# EAGLE design placa esp 30 pins V1 (EAGLE 7.2.0)
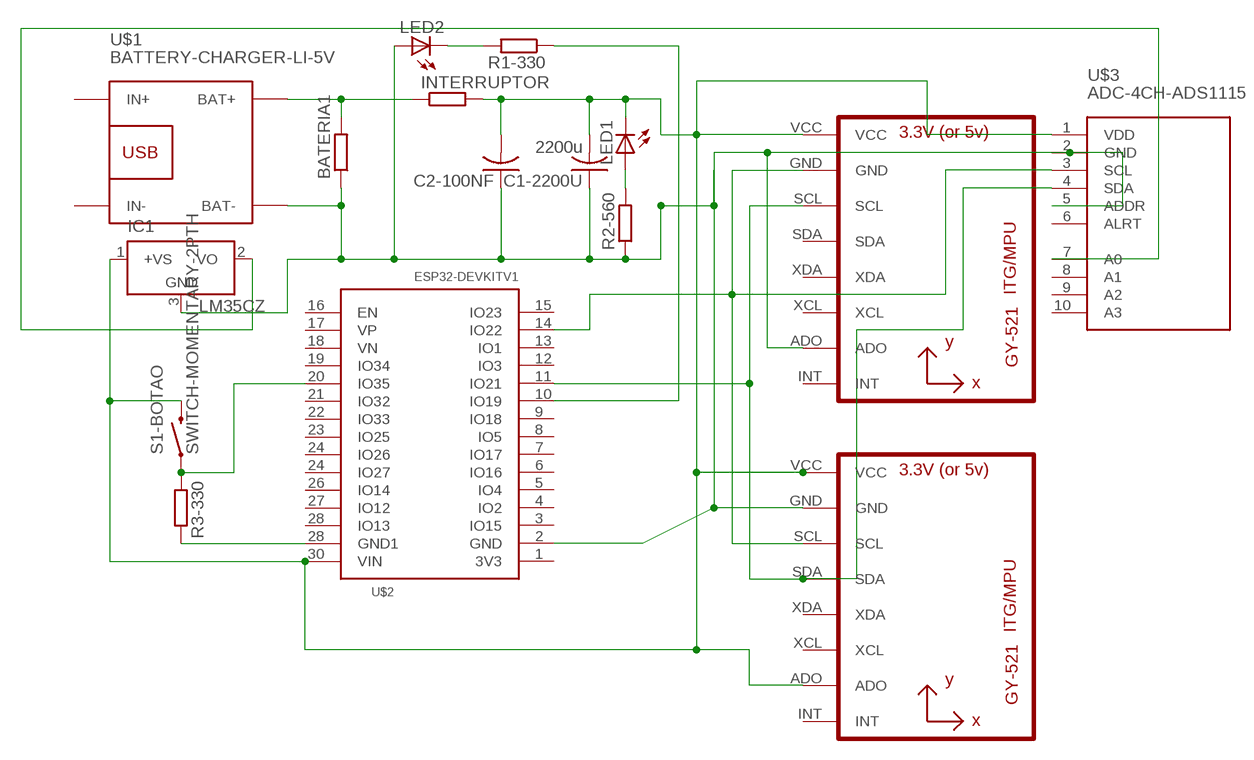
[diagram p0: schematic, sheet 1]

## Parts
BATERIA1  R-EU_0207/10  [0207/10]
C1-2200U  2200u  C-US025-060X050  [C025-060X050]
C2-100NF  C-US025-060X050  [C025-060X050]
IC1  LM35CZ  [TO92]
INTERRUPTOR  R-EU_0207/7  [0207/7]
LED1  LEDLD260  [LD260]
LED2  LEDLD260  [LD260]
OXIMETRO  GY-521MPU6050  [GY-521]
R1-330  R-EU_0207/10  [0207/10]
R2-560  R-EU_0207/10  [0207/10]
R3-330  R-EU_0207/10  [0207/10]
S1-BOTAO  SWITCH-MOMENTARY-2PTH  [TACTILE-PTH]
U2  GY-521MPU6050  [GY-521]
U$1  BATTERY-CHARGER-LI-5V  [BATTERY-CHARGER-LI-5V]
U$2  ESP32DEVKITV1  [ESP32-DEVKITV1]
U$3  ADC-4CH-ADS1115  [ADC-4CH-ADS1115]

## Nets
N$1: C1-2200U.2 C2-100NF.2 IC1.1(+VS) INTERRUPTOR.2 LED1.K(C) OXIMETRO.VCC S1-BOTAO.3 U2.ADO U2.VCC U$2.30(VIN) U$3.1(VDD)
N$3: OXIMETRO.GND U2.SCL U$2.14(IO22) U$3.3(SCL)
N$4: R3-330.1 S1-BOTAO.1 U$2.20(IO35)
N$5: IC1.2(VO) U$3.7(A0)
N$6: OXIMETRO.SCL U2.SDA U$2.11(IO21) U$3.4(SDA)
N$8: R3-330.2 U$2.28(GND1)
N$9: LED1.A R2-560.2
N$10: BATERIA1.2 INTERRUPTOR.1 U$1.BAT+
N$11: LED2.K(C) R1-330.2
N$12: BATERIA1.1 C1-2200U.1 C2-100NF.1 IC1.3(GND) LED2.A OXIMETRO.ADO R2-560.1 U2.GND U$1.BAT- U$2.2(GND) U$3.2(GND) U$3.5(ADDR)
N$13: R1-330.1 U$2.10(IO19)
Unconnected: OXIMETRO.INT OXIMETRO.SDA OXIMETRO.XCL OXIMETRO.XDA U2.INT U2.XCL U2.XDA U$1.IN+ U$1.IN- U$2.1(3V3) U$2.3(IO15) U$2.4(IO2) U$2.5(IO4) U$2.6(IO16) U$2.7(IO17) U$2.8(IO5) U$2.9(IO18) U$2.12(IO3) U$2.13(IO1) U$2.15(IO23) U$2.16(EN) U$2.17(VP) U$2.18(VN) U$2.19(IO34) U$2.21(IO32) U$2.22(IO33) U$2.23(IO25) U$2.24(IO26) U$2.24(IO27) U$2.26(IO14) U$2.27(IO12) U$2.28(IO13) U$3.6(ALRT) U$3.8(A1) U$3.9(A2) U$3.10(A3)

## Library data of the parts
BATERIA1 INTERRUPTOR R1-330 R2-560 R3-330 = resistor:R-EU_: RESISTOR, European symbol
C1-2200U C2-100NF = resistor:C-US: CAPACITOR, American symbol
IC1 = lm35:LM35: Single-Supply Centigrade Temperature Sensor Vout = (10mV/°C x Temp °C) +5mmmV Source: http://www.national.com/ds/LM/LM35.pdf
LED1 LED2 = led:LED: LED OSRAM: - CHIPLED LG R971, LG N971, LY N971, LG Q971, LY Q971, LO R971, LY R971 LH N974, LH R974 LS Q976, LO Q976, LY Q976 LO Q996 - Hyper CHIPLED LW Q18S LB Q993, LB Q99A, LB R99A - SideLED LS A670, LO A670, LY A670, LG A670, LP A670 LB A673, LV A673, LT A673, LW A673 LH A674 LY A675 LS A676, LA A676, LO A676, LY A676, LW A676 LS A679, LY A679, LG A679 - Hyper Micro SIDELED® LS Y876, LA Y876, LO Y876, LY Y876 LT Y87S - SmartLED LW L88C, LW L88S LB L89C, LB L89S, LG L890 LS L89K, LO L89K, LY L89K LS L896, LA L896, LO L896, LY L896 - TOPLED LS T670, LO T670, LY T670, LG T670, LP T670 LSG T670, LSP T670, LSY T670, LOP T670, LYG T670 LG T671, LOG T671, LSG T671 LB T673, LV T673, LT T673, LW T673 LH T674 LS T676, LA T676, LO T676, LY T676, LB T676, LH T676, LSB T676, LW T676 LB T67C, LV T67C, LT T67C, LS T67K, LO T67K, LY T67K, LW E67C LS E67B, LA E67B, LO E67B, LY E67B, LB E67C, LV E67C, LT E67C LW T67C LS T679, LY T679, LG T679 LS T770, LO T770, LY T770, LG T770, LP T770 LB T773, LV T773, LT T773, LW T773 LH T774 LS E675, LA E675, LY E675, LS T675 LS T776, LA T776, LO T776, LY T776, LB T776 LHGB T686 LT T68C, LB T68C - Hyper Mini TOPLED® LB M676 - Mini TOPLED Santana® LG M470 LS M47K, LO M47K, LY M47K Source: http://www.osram.convergy.de LUXEON: - LUMILED® LXK2-PW12-R00, LXK2-PW12-S00, LXK2-PW14-U00, LXK2-PW14-V00 LXK2-PM12-R00, LXK2-PM12-S00, LXK2-PM14-U00 LXK2-PE12-Q00, LXK2-PE12-R00, LXK2-PE12-S00, LXK2-PE14-T00, LXK2-PE14-U00 LXK2-PB12-K00, LXK2-PB12-L00, LXK2-PB12-M00, LXK2-PB14-N00, LXK2-PB14-P00, LXK2-PB14-Q00 LXK2-PR12-L00, LXK2-PR12-M00, LXK2-PR14-Q00, LXK2-PR14-R00 LXK2-PD12-Q00, LXK2-PD12-R00, LXK2-PD12-S00 LXK2-PH12-R00, LXK2-PH12-S00 LXK2-PL12-P00, LXK2-PL12-Q00, LXK2-PL12-R00 Source: www.luxeon.com KINGBRIGHT: KA-3528ASYC Source: www.kingbright.com
OXIMETRO U2 = gy-521:GY-521
S1-BOTAO = SparkFun-Electromechanical:SWITCH-MOMENTARY-2: Various NO switches- pushbuttons, reed, etc; PROD_ID: SWCH-08441
U$1 = diy-modules:BATTERY-CHARGER-LI-5V: Lithium Battery 5V Charger
U$2 = ESP32-DEVKITV1:ESP32DEVKITV1
U$3 = diy-modules (1):ADC-4CH-ADS1115: 4 Channel 16-Bit Analog-to-Digital Converter based on ADS1115 chip Arduino ADS1115 Getting Started Tutorial is available here: http://henrysbench.capnfatz.com/henrys-bench/arduino-voltage-measurements/arduino-ads1115-module-getting-started-tutorial/ ADS1115 datasheet is available here: http://www.ti.com/lit/ds/symlink/ads1115.pdf Click here to find device on ebay.com <http://www.ebay.com/sch/ads1115+module>

## Board
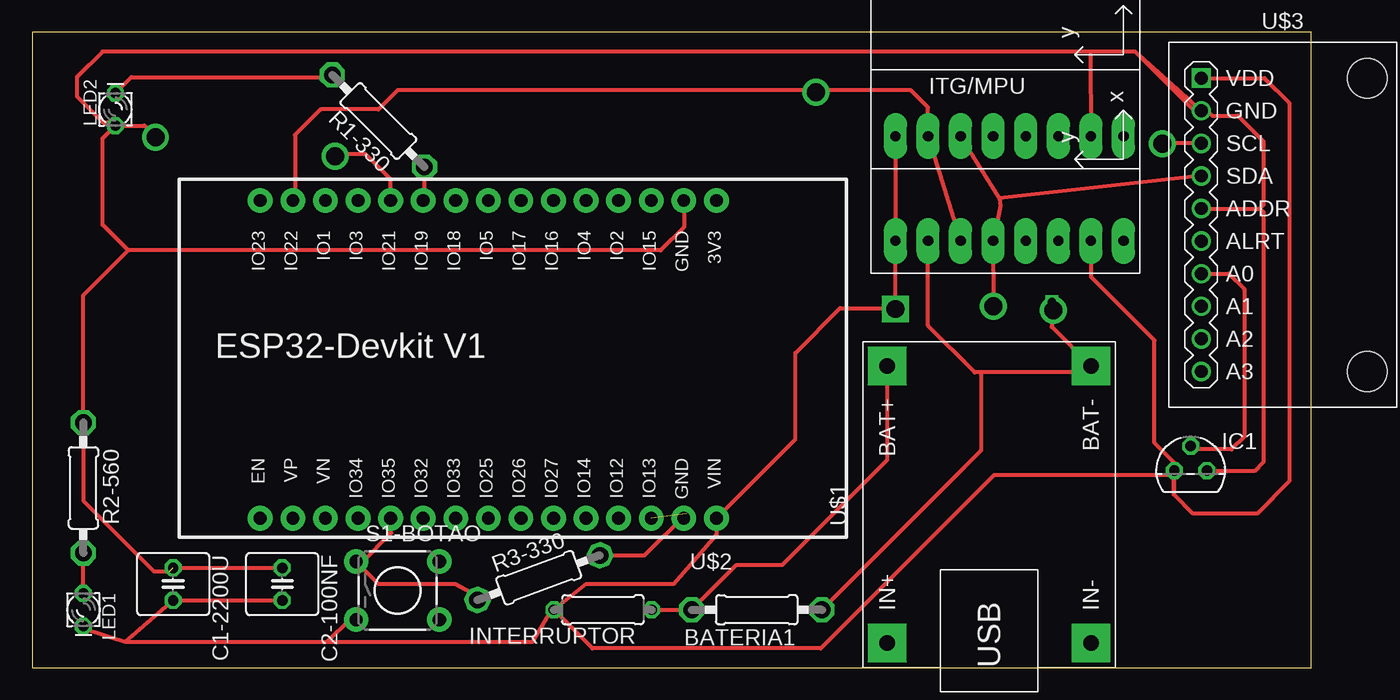
[diagram p1: board, top side]
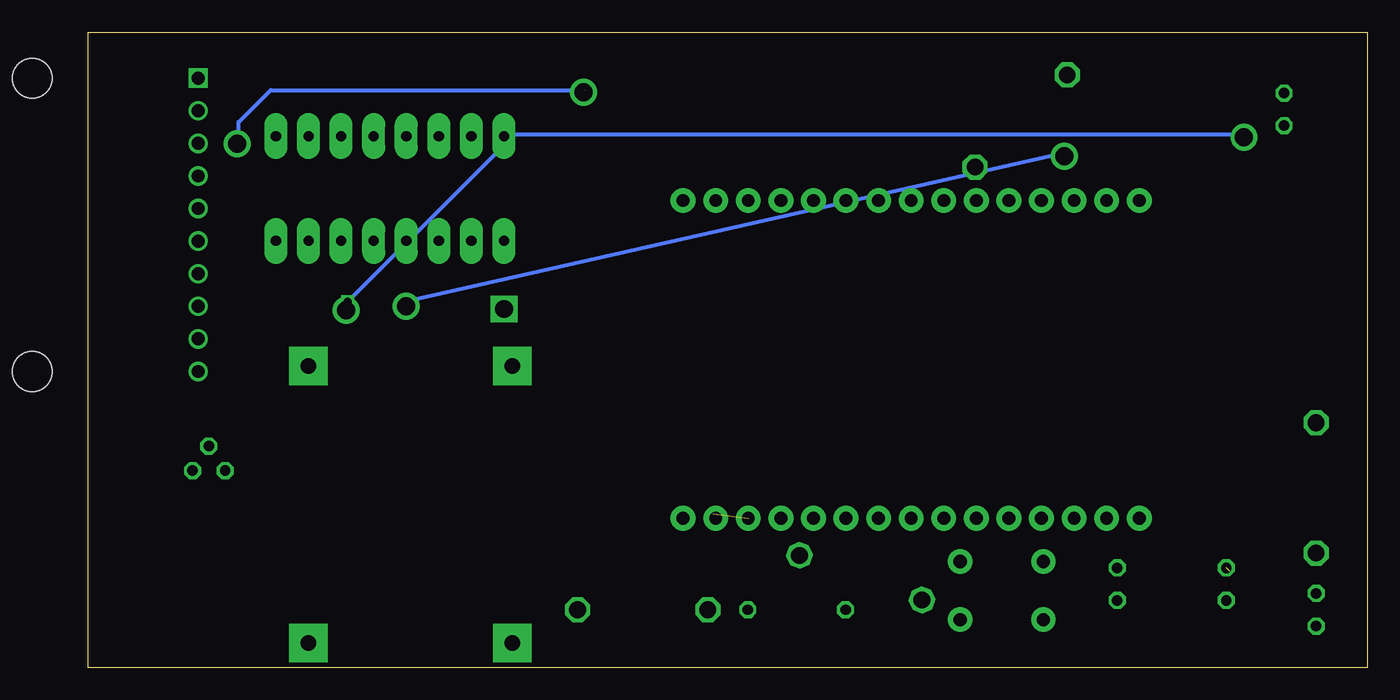
[diagram p2: board, bottom side, seen from below]

Size 99.73 x 49.52 mm. Coordinates in mm from the lower left corner, seen from the top.
Outline: 0,0 99.73,0 99.73,49.52 0,49.52 0,0
Copper layers (1*16): Top 0.035mm / dielectric 1.5mm / Bottom 0.035mm
Design rules "default": minimum track width 10mil, minimum drill 24mil, track to track 8mil, track to pad 8mil, pad to pad 8mil, via to via 8mil, smd to smd 8mil, copper to edge 40mil, drill to drill 8mil, minimum pad ring 10mil, minimum via ring 8mil, stop-mask expansion 4mil, vias tented up to drill 0mil, thermal gap 10mil

### Footprints (pad centres in the part's own frame; a part is rotated, then mirrored left to right if it is on the bottom)
0207/10 = drill 1.3 octagon: 1 -5.08,0; 2 5.08,0
C025-060X050 = drill 0.813 octagon: 1 -1.27,0; 2 1.27,0
TO92 = drill 0.813 octagon: 1 -1.27,0; 2 0,1.905; 3 1.27,0
0207/7 = drill 0.813 octagon: 1 -3.81,0; 2 3.81,0
LD260 = drill 0.813 octagon: A -1.27,0; K 1.27,0
GY-521 = drill 0.8 pad 1.778 long: ADO -8.89,-6.35; GND -8.89,6.35; INT -8.89,-8.89; SCL -8.89,3.81; SDA -8.89,1.27; VCC -8.89,8.89; XCL -8.89,-3.81; XDA -8.89,-1.27
TACTILE-PTH = drill 1.016 pad 1.88: 1 -3.251,2.261; 2 3.251,2.261; 3 -3.251,-2.261; 4 3.251,-2.261
BATTERY-CHARGER-LI-5V = drill 1.2 pad 3 square: BAT+ 10.795,8.255; BAT- 10.795,-7.62; IN+ -10.795,8.255; IN- -10.795,-7.62
ESP32-DEVKITV1 = drill 1 pad 1.93: 1 -22.87,-13.54; 2 -20.33,-13.54; 3 -17.79,-13.54; 4 -15.25,-13.54; 5 -12.71,-13.54; 6 -10.17,-13.54; 7 -7.63,-13.54; 8 -5.09,-13.54; 9 -2.55,-13.54; 10 -0.01,-13.54; 11 2.53,-13.54; 12 5.07,-13.54; 13 7.61,-13.54; 14 10.15,-13.54; 15 12.69,-13.54; 16 12.69,11.23; 17 10.15,11.23; 18 7.61,11.23; 19 5.07,11.23; 20 2.53,11.23; 21 -0.01,11.23; 22 -2.55,11.23; 23 -5.09,11.23; 24 -7.63,11.23; 25 -10.17,11.23; 26 -12.71,11.23; 27 -15.25,11.23; 28 -17.79,11.23; 29 -20.33,11.23; 30 -22.87,11.23
ADC-4CH-ADS1115 = drill 1 square: 1 -6.35,11.43 | drill 1: 2 -6.35,8.89; 3 -6.35,6.35; 4 -6.35,3.81; 5 -6.35,1.27; 6 -6.35,-1.27; 7 -6.35,-3.81; 8 -6.35,-6.35; 9 -6.35,-8.89; 10 -6.35,-11.43 | hole 3.1: 6.604,11.43; 6.604,-11.43

### Placement (x,y rotation side)
BATERIA1  56.5,4.5 180 top
C1-2200U  11,6.5 270 top
C2-100NF  19.5,6.5 270 top
IC1  90.32,15.35 0 top
INTERRUPTOR  44.5,4.5 180 top
LED1  4,4.5 270 top
LED2  6.5,43.5 90 top
OXIMETRO  76.2,50.3 90 top
R1-330  27,42.59 135 top
R2-560  4,14 270 top
R3-330  39.5,7 20 top
S1-BOTAO  28.5,6 0 top
U2  76.2,42.14 90 top
U$1  74.93,12.7 90 top
U$2  30.48,22.86 180 top
U$3  97.5,34.5 0 top

### Tracks (layer width: path | path; a pad name or v marks a point on that pad's centre or on a via)
N$1
  Top 0.305: OXIMETRO.VCC U2.VCC 67.31,28.19 67.5,28 63,28 59.5,24.5 59.5,17.78 U$2.30 53.35,10.35 50,6.5 43.19,6.5 INTERRUPTOR.2 | LED1.K 4.23,3 7.27,2 | 7.27,2 23,2 | 23,2 39,2 40.5,4.5 INTERRUPTOR.2 | 89.05,13.45 90.5,12 95.5,12 98,14.5 98,44 96.07,45.93 U$3.1 | 89.05,13.45 IC1.1 | 89.05,13.45 89,13.5 89,15 | 89,15 89,16 87.5,17.5 87.5,25.5 82.55,30.45 U2.ADO | 89,15 75,15 61.5,1.5 43.69,1.5 INTERRUPTOR.2 | 7.27,2 C1-2200U.2 C2-100NF.2 | S1-BOTAO.3 24.74,3.74 23,2
N$3  (via drill 0.6)  (1 unrouted)
  Top 0.305: U2.SCL OXIMETRO.GND 69.85,43.65 68.5,45 28.5,45 27,43.5 22.5,43.5 20.5,41.5 20.5,36.57 U$2.14 | U$3.3 88.35,40.85 v88,40.5
  Bottom 0.305: v88,40.5 88,42.5 85.5,45 61,45
N$4
  Top 0.305: U$2.20 28,11.58 28,10.5 25.76,8.26 S1-BOTAO.1 27.01,6.5 33,6.5 34.92,5.42 R3-330.1
N$5
  Top 0.305: U$3.7 93.31,30.69 94.5,29.5 94.5,18 93.5,17 90.58,17 IC1.2
N$6  (via drill 0.6)
  Top 0.305: U$3.4 75.42,36.56 | 75.42,36.56 75.5,36 U2.SDA v75,28.5 | OXIMETRO.SCL 75.42,36.56 | U$2.11 27.95,38.05 26,40 v24,40
  Bottom 0.305: v24,40 v75,28.5
N$7  (via drill 1.4)
  other vias: 67.31,27.94
N$8  (1 unrouted)
  Top 0.305: R3-330.2 47.74,8.74 51,12
N$9
  Top 0.305: LED1.A R2-560.2
N$10
  Top 0.305: INTERRUPTOR.1 BATERIA1.2 54.92,8 58.5,8 66.67,16.18 U$1.BAT+
N$11
  Top 0.305: LED2.K 7.73,46 23,46 23.32,45.68 R1-330.2
N$12  (via drill 0.6)  (1 unrouted)
  Top 0.305: 74,23 82.06,23 U$1.BAT- 79.5,26.55 v79.5,28.5 | 74,23 73.5,23 69.85,26.65 U2.GND | BATERIA1.1 74,16.92 74,23 | U$3.5 95.73,35.77 | 95.73,35.77 96,35.5 96,16 95.35,15.35 IC1.3 | U$3.2 86,48 | 86,48 82.5,48 | 82.5,48 OXIMETRO.ADO | LED2.A 5.5,41.23 5.5,34.5 7.5,32.5 | LED2.A 8.77,42.23 v9.5,41.5 | U$2.2 50.81,34.31 49,32.5 7.5,32.5 | 86,48 90.5,43.5 91.5,43.5 92,43 94,43 96,41 96,36.04 95.73,35.77 | 82.5,48 5.5,48 3.5,46 3.5,44.5 5.5,42.5 6.23,42.5 LED2.A | 7.5,32.5 4,29 R2-560.1 4,13 9.5,7.5 10.73,7.5 | C1-2200U.1 C2-100NF.1 | C2-100NF.1 19.77,7.77 20,8 19.73,8 C2-100NF.1
  Bottom 0.305: v9.5,41.5 66.5,41.5 v79.5,28.5
N$13
  Top 0.305: U$2.10 30.59,36.5 R1-330.1
N$15  (via drill 1.4)
  other vias: 74.93,28.17
N$17  (via drill 1.4)
  other vias: 9.62,41.33 23.62,39.83 61.12,44.83 79.62,27.83 88.12,40.83